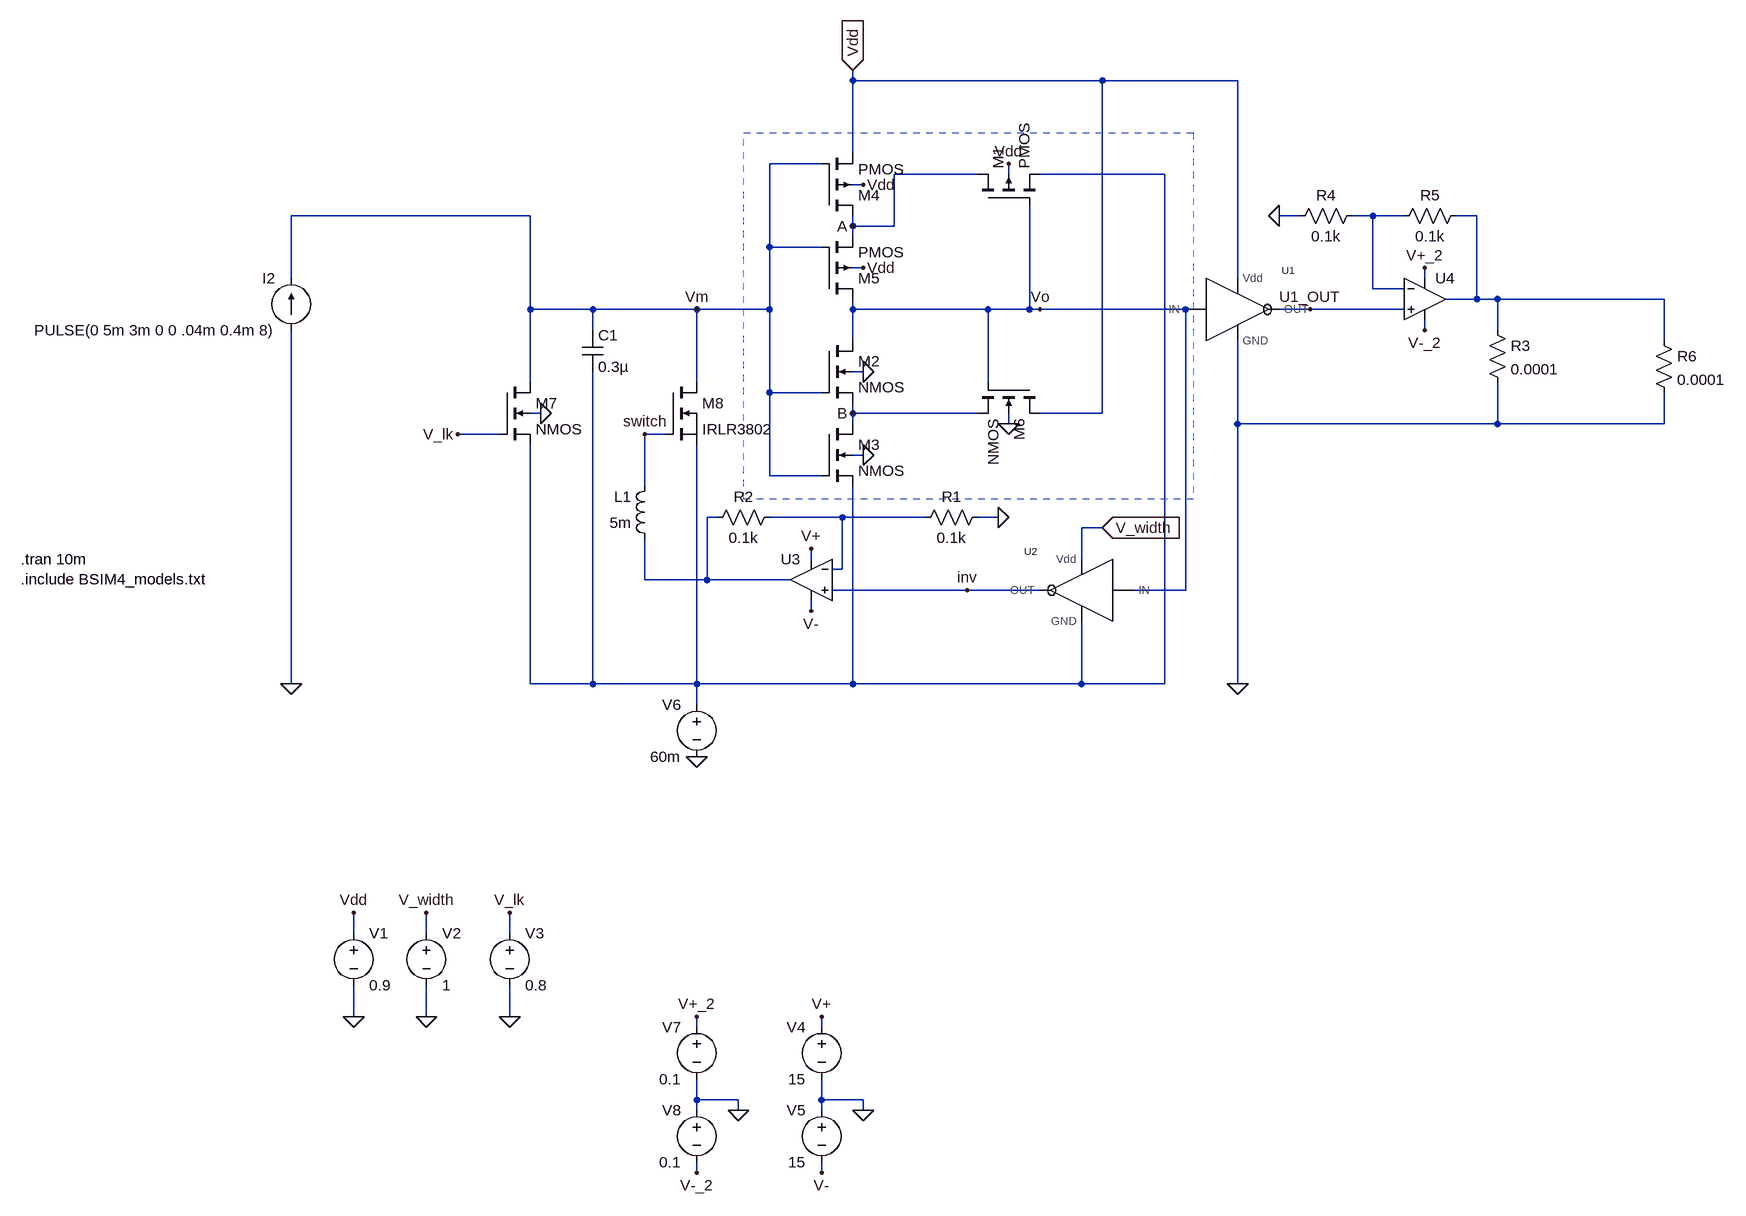
[diagram p0: schematic Inductor_Neuron.asc]
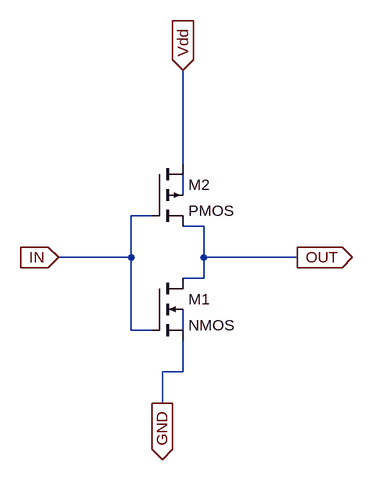
[diagram p1: sub-circuit cmos_inv.asc]
Inductor_Neuron.asc, the LTspice schematic file:
Version 4
SHEET 1 4384 1932
WIRE 1024 160 1024 144
WIRE 1408 160 1024 160
WIRE 1616 160 1408 160
WIRE 1024 272 1024 160
WIRE 976 288 896 288
WIRE 1216 304 1088 304
WIRE 1264 304 1264 288
WIRE 1504 304 1312 304
WIRE 1040 320 1024 320
WIRE 528 368 160 368
WIRE 1712 368 1680 368
WIRE 1824 368 1792 368
WIRE 1872 368 1824 368
WIRE 1984 368 1952 368
WIRE 1024 384 1024 368
WIRE 1088 384 1088 304
WIRE 1088 384 1024 384
WIRE 1024 400 1024 384
WIRE 896 416 896 288
WIRE 976 416 896 416
WIRE 1040 448 1024 448
WIRE 160 464 160 368
WIRE 1616 464 1616 160
WIRE 1904 464 1904 448
WIRE 1824 480 1824 368
WIRE 1872 480 1824 480
WIRE 1984 496 1984 368
WIRE 1984 496 1936 496
WIRE 2016 496 1984 496
WIRE 2272 496 2016 496
WIRE 528 512 528 368
WIRE 624 512 528 512
WIRE 784 512 624 512
WIRE 896 512 896 416
WIRE 896 512 784 512
WIRE 1024 512 1024 496
WIRE 1232 512 1024 512
WIRE 1296 512 1296 352
WIRE 1296 512 1232 512
WIRE 1312 512 1296 512
WIRE 1536 512 1312 512
WIRE 1728 512 1680 512
WIRE 1872 512 1728 512
WIRE 624 544 624 512
WIRE 1904 544 1904 528
WIRE 2016 544 2016 496
WIRE 1024 560 1024 512
WIRE 2272 560 2272 496
WIRE 1040 608 1024 608
WIRE 528 624 528 512
WIRE 784 624 784 512
WIRE 1232 624 1232 512
WIRE 896 640 896 512
WIRE 976 640 896 640
WIRE 544 672 528 672
WIRE 1024 672 1024 656
WIRE 1216 672 1024 672
WIRE 1408 672 1408 160
WIRE 1408 672 1312 672
WIRE 1024 688 1024 672
WIRE 1264 688 1264 672
WIRE 1616 688 1616 560
WIRE 2016 688 2016 624
WIRE 2016 688 1616 688
WIRE 2272 688 2272 640
WIRE 2272 688 2016 688
WIRE 480 704 416 704
WIRE 736 704 704 704
WIRE 1040 736 1024 736
WIRE 896 768 896 640
WIRE 976 768 896 768
WIRE 704 784 704 704
WIRE 816 832 800 832
WIRE 1008 832 896 832
WIRE 1136 832 1008 832
WIRE 1248 832 1216 832
WIRE 1408 848 1376 848
WIRE 960 896 960 880
WIRE 1376 896 1376 848
WIRE 1008 912 1008 832
WIRE 1008 912 992 912
WIRE 704 928 704 864
WIRE 800 928 800 832
WIRE 800 928 704 928
WIRE 928 928 800 928
WIRE 1200 944 992 944
WIRE 1312 944 1200 944
WIRE 1536 944 1536 512
WIRE 1536 944 1456 944
WIRE 960 976 960 960
WIRE 160 1088 160 544
WIRE 528 1088 528 720
WIRE 624 1088 624 608
WIRE 624 1088 528 1088
WIRE 784 1088 784 720
WIRE 784 1088 624 1088
WIRE 1024 1088 1024 784
WIRE 1024 1088 784 1088
WIRE 1376 1088 1376 992
WIRE 1376 1088 1024 1088
WIRE 1504 1088 1504 304
WIRE 1504 1088 1376 1088
WIRE 1616 1088 1616 688
WIRE 784 1120 784 1088
WIRE 256 1472 256 1440
WIRE 368 1472 368 1440
WIRE 496 1472 496 1440
WIRE 256 1600 256 1552
WIRE 368 1600 368 1552
WIRE 496 1600 496 1552
WIRE 784 1616 784 1600
WIRE 976 1616 976 1600
WIRE 784 1728 784 1696
WIRE 848 1728 784 1728
WIRE 976 1728 976 1696
WIRE 1040 1728 976 1728
WIRE 784 1744 784 1728
WIRE 848 1744 848 1728
WIRE 976 1744 976 1728
WIRE 1040 1744 1040 1728
WIRE 784 1840 784 1824
WIRE 976 1840 976 1824
FLAG 1024 144 Vdd
IOPIN 1024 144 In
FLAG 784 512 Vm
FLAG 1312 512 Vo
FLAG 416 704 V_lk
FLAG 1040 320 Vdd
FLAG 1040 448 Vdd
FLAG 1040 608 0
FLAG 1040 736 0
FLAG 1264 688 0
FLAG 1264 288 Vdd
FLAG 1024 672 B
FLAG 1024 384 A
FLAG 1728 512 U1_OUT
FLAG 256 1600 0
FLAG 368 1600 0
FLAG 496 1600 0
FLAG 256 1440 Vdd
FLAG 368 1440 V_width
FLAG 496 1440 V_lk
FLAG 160 1088 0
FLAG 544 672 0
FLAG 1408 848 V_width
IOPIN 1408 848 In
FLAG 976 1840 V-
FLAG 976 1600 V+
FLAG 1040 1744 0
FLAG 784 1200 0
FLAG 1248 832 0
FLAG 960 880 V+
FLAG 960 976 V-
FLAG 704 704 switch
FLAG 1200 944 inv
FLAG 1680 368 0
FLAG 784 1840 V-_2
FLAG 784 1600 V+_2
FLAG 848 1744 0
FLAG 1904 448 V+_2
FLAG 1904 544 V-_2
FLAG 1616 1088 0
SYMBOL cap 608 544 R0
SYMATTR InstName C1
SYMATTR Value 0.3µ
SYMATTR SpiceLine Rser=333k Cpar=0.0000003
SYMBOL CMOS_INV 1600 512 R0
SYMATTR InstName U1
SYMBOL pmos4 1216 352 R270
SYMATTR InstName M1
SYMATTR Value2 l=50n w=1u
SYMBOL nmos4 976 560 R0
SYMATTR InstName M2
SYMATTR Value2 l=50n w=500n
SYMBOL nmos4 976 688 R0
SYMATTR InstName M3
SYMATTR Value2 l=50n w=500n
SYMBOL pmos4 976 368 M180
SYMATTR InstName M4
SYMATTR Value2 l=50n w=1.3u
SYMBOL pmos4 976 496 M180
SYMATTR InstName M5
SYMATTR Value2 l=50n w=1u
SYMBOL nmos4 1312 624 R90
SYMATTR InstName M6
SYMATTR Value2 l=50n w=1.125u
SYMBOL voltage 256 1456 R0
SYMATTR InstName V1
SYMATTR Value 0.9
SYMBOL voltage 368 1456 R0
SYMATTR InstName V2
SYMATTR Value 1
SYMBOL voltage 496 1456 R0
SYMATTR InstName V3
SYMATTR Value 0.8
SYMBOL nmos4 480 624 R0
SYMATTR InstName M7
SYMATTR Value2 l=5u w=500u
SYMBOL CMOS_INV 1392 944 M0
SYMATTR InstName U2
SYMBOL nmos 736 624 R0
SYMATTR InstName M8
SYMATTR Value IRLR3802
SYMBOL voltage 976 1600 M0
SYMATTR InstName V4
SYMATTR Value 15
SYMBOL voltage 976 1728 M0
SYMATTR InstName V5
SYMATTR Value 15
SYMBOL voltage 784 1104 M0
SYMATTR InstName V6
SYMATTR Value 60m
SYMBOL OpAmps/UniversalOpamp2 960 928 M0
SYMATTR InstName U3
SYMBOL res 1232 816 R90
WINDOW 0 0 56 VBottom 2
WINDOW 3 32 56 VTop 2
SYMATTR InstName R1
SYMATTR Value 0.1k
SYMBOL res 912 816 R90
WINDOW 0 0 56 VBottom 2
WINDOW 3 32 56 VTop 2
SYMATTR InstName R2
SYMATTR Value 0.1k
SYMBOL ind 720 880 R180
WINDOW 0 36 80 Left 2
WINDOW 3 36 40 Left 2
SYMATTR InstName L1
SYMATTR Value 5m
SYMATTR SpiceLine Rser=0.000000005
SYMBOL res 2000 528 R0
SYMATTR InstName R3
SYMATTR Value 0.0001
SYMBOL OpAmps/UniversalOpamp2 1904 496 R0
SYMATTR InstName U4
SYMBOL res 1808 352 R90
WINDOW 0 0 56 VBottom 2
WINDOW 3 32 56 VTop 2
SYMATTR InstName R4
SYMATTR Value 0.1k
SYMBOL res 1968 352 R90
WINDOW 0 0 56 VBottom 2
WINDOW 3 32 56 VTop 2
SYMATTR InstName R5
SYMATTR Value 0.1k
SYMBOL voltage 784 1600 M0
SYMATTR InstName V7
SYMATTR Value 0.1
SYMBOL voltage 784 1728 M0
SYMATTR InstName V8
SYMATTR Value 0.1
SYMBOL res 2256 544 R0
SYMATTR InstName R6
SYMATTR Value 0.0001
SYMBOL current 160 544 R180
WINDOW 0 24 80 Left 2
WINDOW 3 24 0 Left 2
SYMATTR InstName I2
SYMATTR Value PULSE(0 5m 3m 0 0 .04m 0.4m 8)
TEXT -256 896 Left 2 !.tran 10m\n.include BSIM4_models.txt
RECTANGLE Normal 856 240 1548 804 2

cmos_inv.asc, the sub-circuit schematic file:
Version 4
SHEET 1 1000 684
WIRE 432 208 432 64
WIRE 432 256 432 224
WIRE 384 288 352 288
WIRE 464 304 432 304
WIRE 352 352 352 288
WIRE 352 352 240 352
WIRE 464 352 464 304
WIRE 608 352 464 352
WIRE 464 384 464 352
WIRE 464 384 432 384
WIRE 352 464 352 352
WIRE 384 464 352 464
WIRE 432 464 432 432
WIRE 432 528 432 480
WIRE 432 528 400 528
WIRE 400 576 400 528
FLAG 400 576 GND
IOPIN 400 576 Out
FLAG 432 64 Vdd
IOPIN 432 64 In
FLAG 240 352 IN
IOPIN 240 352 In
FLAG 608 352 OUT
IOPIN 608 352 Out
SYMBOL nmos4 384 384 R0
SYMATTR InstName M1
SYMATTR Value2 l=50n w=500n
SYMBOL pmos4 384 208 R0
SYMATTR InstName M2
SYMATTR Value2 l=50n w=1u

The netlist it stands for:
* Inductor_Neuron.asc
C1 Vm N001 0.3µ Rser=333k Cpar=0.0000003
XU1 Vo Vdd 0 U1_OUT cmos_inv
M1 A Vo N001 Vdd PMOS l=50n w=1u
M2 Vo Vm B 0 NMOS l=50n w=500n
M3 B Vm N001 0 NMOS l=50n w=500n
M4 A Vm Vdd Vdd PMOS l=50n w=1.3u
M5 Vo Vm A Vdd PMOS l=50n w=1u
M6 Vdd Vo B 0 NMOS l=50n w=1.125u
V1 Vdd 0 0.9
V2 V_width 0 1
V3 V_lk 0 0.8
M7 Vm V_lk N001 0 NMOS l=5u w=500u
XU2 Vo V_width N001 inv cmos_inv
M8 Vm switch N001 N001 IRLR3802
V4 V+ 0 15
V5 0 V- 15
V6 N001 0 60m
XU3 inv N005 V+ V- N004 level.2 Avol=1Meg GBW=10Meg Slew=10Meg ilimit=25m rail=0 Vos=0 phimargin=45 en=0 enk=0 in=0 ink=0 Rin=500Meg  ; pins IN+ IN- V+ V- OUT
R1 0 N005 0.1k
R2 N005 N004 0.1k
L1 N004 switch 5m Rser=0.000000005
R3 N003 0 0.0001
XU4 U1_OUT N002 V+_2 V-_2 N003 level.2 Avol=1Meg GBW=10Meg Slew=10Meg ilimit=25m rail=0 Vos=0 phimargin=45 en=0 enk=0 in=0 ink=0 Rin=500Meg  ; pins IN+ IN- V+ V- OUT
R4 N002 0 0.1k
R5 N003 N002 0.1k
V7 V+_2 0 0.1
V8 0 V-_2 0.1
R6 N003 0 0.0001
I2 0 Vm PULSE(0 5m 3m 0 0 .04m 0.4m 8)

* block symbol definitions
.subckt cmos_inv IN Vdd GND OUT
M1 OUT IN GND N002 NMOS l=50n w=500n
M2 Vdd IN OUT N001 PMOS l=50n w=1u
.ends cmos_inv

.model NMOS NMOS
.model PMOS PMOS
.lib standard.mos
.tran 10m
.include BSIM4_models.txt
.lib UniversalOpamps2.sub
.backanno
.end